# EAGLE design Sensor_Node_V2 (EAGLE 9.6.2)
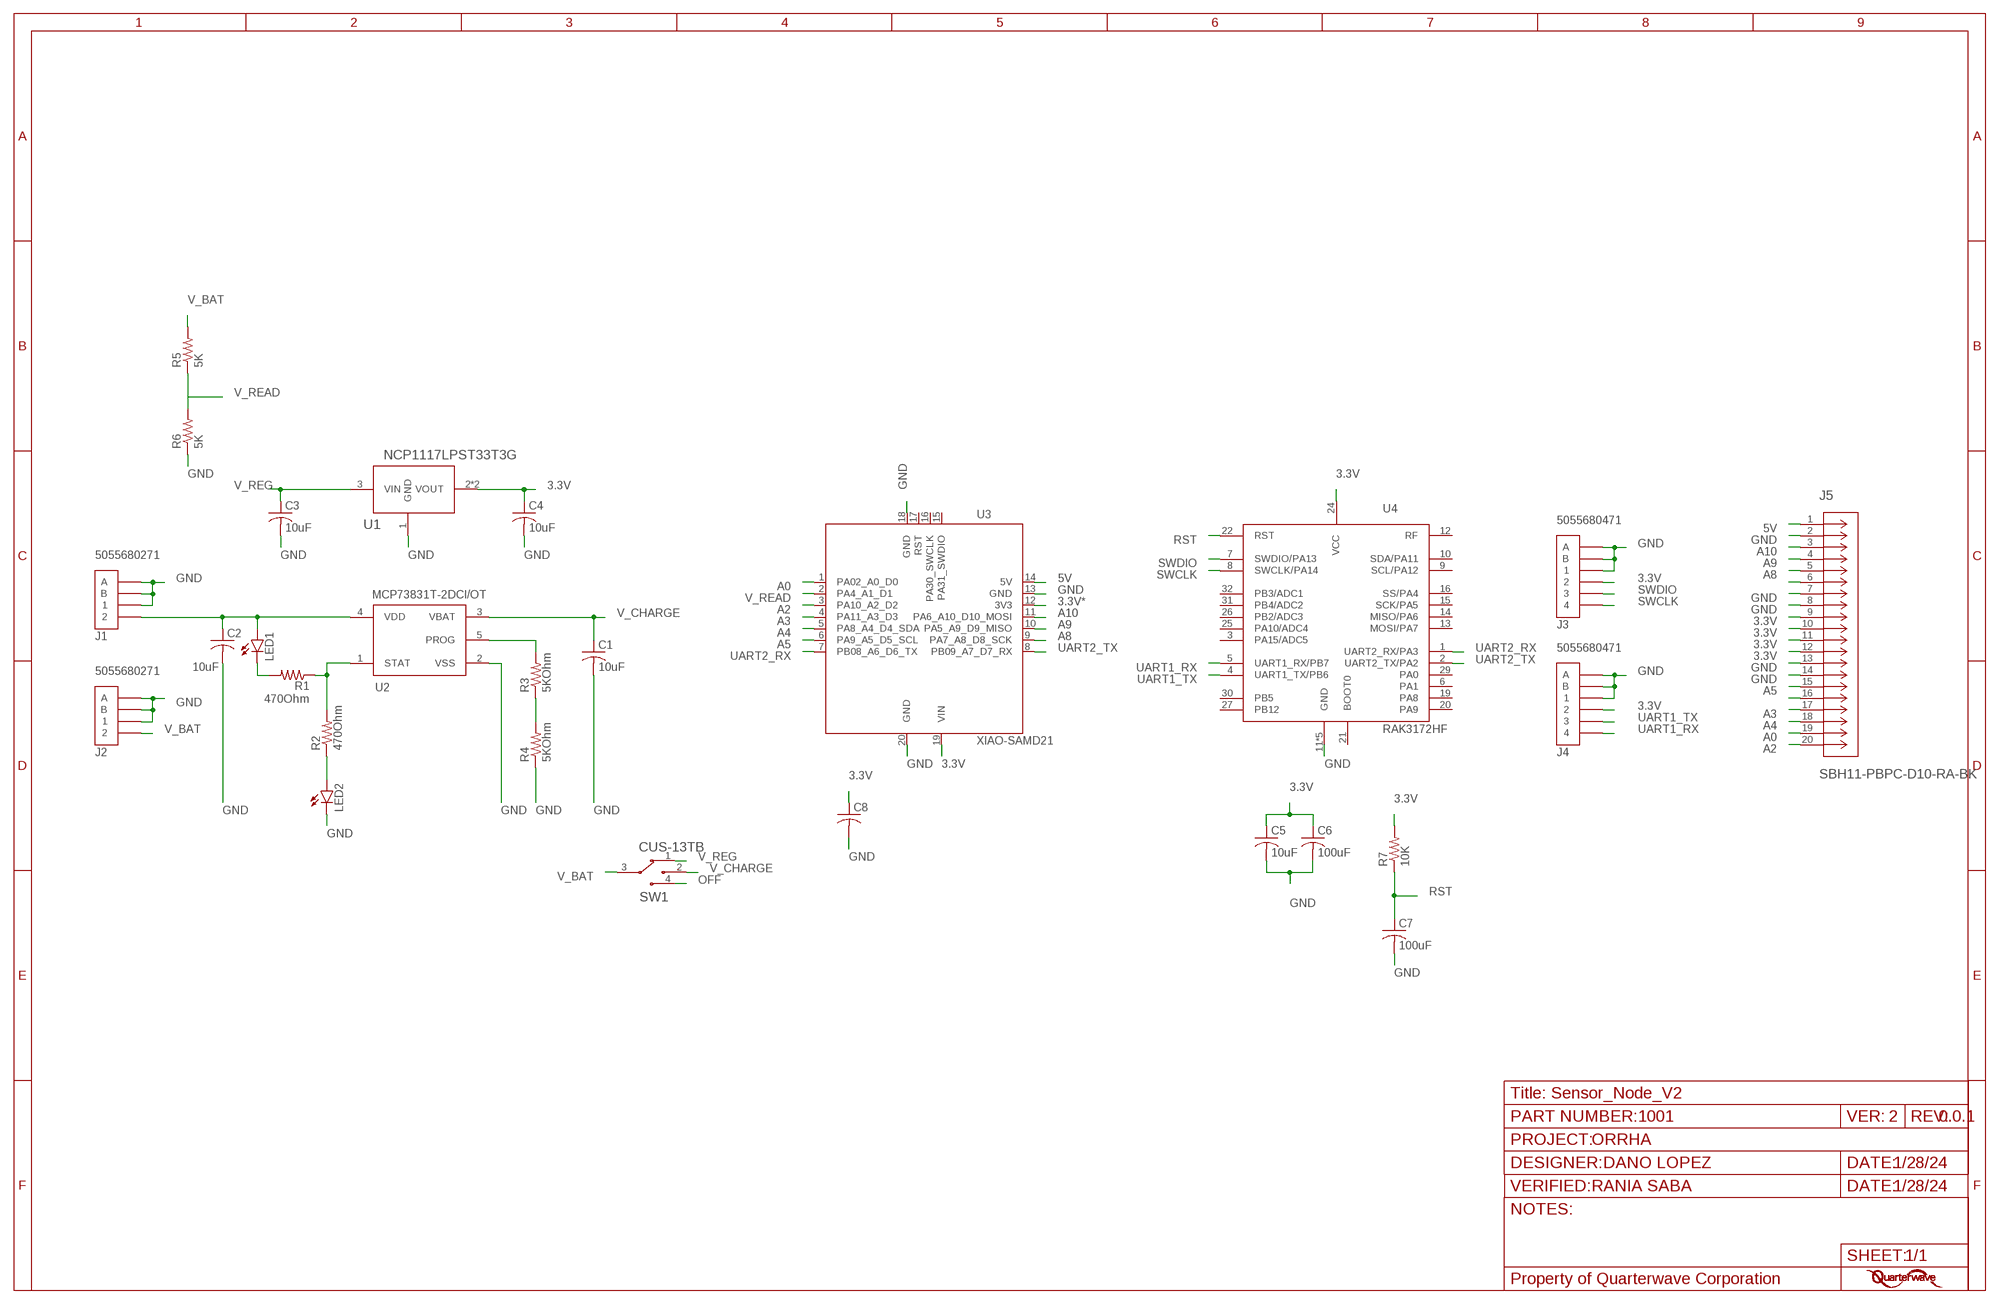
[diagram p0: schematic, sheet 1]

## Parts
C1  10uF  C-USC0805  [C0805]
C2  10uF  C-USC0805  [C0805]
C3  10uF  C-USC0805  [C0805]
C4  10uF  C-USC0805  [C0805]
C5  10uF  C-USC0805  [C0805]
C6  100uF  C-USC0805  [C0805]
C7  100uF  C-USC0805  [C0805]
C8  C-USC0805  [C0805]
FRAME1  STANDARDSTD_INFO_HW14_W30  [STD_INFO_H14_W30]
J1  5055680271  [5055680271]
J2  5055680271  [5055680271]
J3  5055680471  [5055680471]
J4  5055680471  [5055680471]
J5  SBH11-PBPC-D10-RA-BK  [CONN20_D10-RA-BK_SUL]
LED1  LEDCHIPLED_0603  [CHIPLED_0603]
LED2  LEDCHIPLED_0603  [CHIPLED_0603]
R1  470Ohm  R-US_R0805  [R0805]
R2  470Ohm  R-US_R0805  [R0805]
R3  5KOhm  R-US_R0805  [R0805]
R4  5KOhm  R-US_R0805  [R0805]
R5  5K  R-US_R0805  [R0805]
R6  5K  R-US_R0805  [R0805]
R7  10K  R-US_R0805  [R0805]
SW1  CUS-13TB  [CUS-13TB_NDC]
U1  NCP1117LPST33T3G  [SOT-223_DIO]
U2  MCP73831T-2DCI/OT  [SOT-23-5_MC_MCH]
U3  XIAO-SAMD21  [XIAO-SAMD21/RP2040-MODULE14P-2.54-21X17.8MM]
U4  RAK3172HF  [RAK3172]

## Nets
3.3V: C4.1 C5.1 C6.1 C8.1 J3.2 J4.2 J5.9 J5.10 J5.11 J5.12 R7.2 U1.2(VOUT) U1.4(VOUT) U3.19(VIN) U4.24(VCC)
3.3V*: U3.12(3V3)
5V: J5.1 U3.14(5V)
A0: J5.19 U3.1(PA02_A0_D0)
A2: J5.20 U3.3(PA10_A2_D2)
A3: J5.17 U3.4(PA11_A3_D3)
A4: J5.18 U3.5(PA8_A4_D4_SDA)
A5: J5.15 U3.6(PA9_A5_D5_SCL)
A8: J5.5 U3.9(PA7_A8_D8_SCK)
A9: J5.4 U3.10(PA5_A9_D9_MISO)
A10: J5.3 U3.11(PA6_A10_D10_MOSI)
GND: C1.2 C2.2 C3.2 C4.2 C5.2 C6.2 C7.2 C8.2 J1.1 J1.A J1.B J2.1 J2.A J2.B J3.1 J3.A J3.B J4.1 J4.A J4.B J5.2 J5.7 J5.8 J5.13 J5.14 LED2.C R4.1 R6.1 U1.1(GND) U2.2(VSS) U3.13(GND) U3.18(GND) U3.20(GND) U4.11(GND) U4.17(GND) U4.18(GND) U4.23(GND) U4.28(GND)
N$1: LED1.C R1.2
N$2: R1.1 R2.2 U2.1(STAT)
N$3: R3.2 U2.5(PROG)
N$4: R3.1 R4.2
N$7: LED2.A R2.1
N$11: C2.1 J1.2 LED1.A U2.4(VDD)
N$12: J5.6
N$22: J5.16
OFF: SW1.4
RST: C7.1 R7.1 U4.22(RST)
SWCLK: J3.4 U4.8(SWCLK/PA14)
SWDIO: J3.3 U4.7(SWDIO/PA13)
UART1_RX: J4.4 U4.5(UART1_RX/PB7)
UART1_TX: J4.3 U4.4(UART1_TX/PB6)
UART2_RX: U3.7(PB08_A6_D6_TX) U4.1(UART2_RX/PA3)
UART2_TX: U3.8(PB09_A7_D7_RX) U4.2(UART2_TX/PA2)
V_BAT: J2.2 R5.2 SW1.3
V_CHARGE: C1.1 SW1.2 U2.3(VBAT)
V_READ: R5.1 R6.2 U3.2(PA4_A1_D1)
V_REG: C3.1 SW1.1 U1.3(VIN)
Unconnected: U3.15(PA31_SWDIO) U3.16(PA30_SWCLK) U3.17(RST) U4.3(PA15/ADC5) U4.6(PA1) U4.9(SCL/PA12) U4.10(SDA/PA11) U4.12(RF) U4.13(MOSI/PA7) U4.14(MISO/PA6) U4.15(SCK/PA5) U4.16(SS/PA4) U4.19(PA8) U4.20(PA9) U4.21(BOOT0) U4.25(PA10/ADC4) U4.26(PB2/ADC3) U4.27(PB12) U4.29(PA0) U4.30(PB5) U4.31(PB4/ADC2) U4.32(PB3/ADC1)

## Library data of the parts
C1-C8 = rcl:C-US: CAPACITOR, American symbol; SPICEPREFIX: C
FRAME1 = QW Frame:STANDARD: FRAME B Size , 11 x 17 INCH, Landscape; COMPLETE_DATE: 1/28/24; DESIGNER_NAME: DANO LOPEZ; PART_NUMBER: 1001; PROJECT_NAME: ORRHA; R: 0.0.1; V: 2; VERIFIER_NAME: RANIA SABA; VERIFY_DATE: 1/28/24
J1 J2 = Micro-Lock Plus:5055680271: Connector Header Surface Mount 2 position 0.049" (1.25mm)
J3 J4 = Micro-Lock Plus:5055680471: Connector Header Surface Mount 4 position 0.049" (1.25mm)
J5 = SBH11-PBPC-D10-RA-BK:SBH11-PBPC-D10-RA-BK: SBH11-PBPC-D10-RA-BK Package: Through Hole, Right Angle Part Number: SBH11-PBPC-D10-RA-BK Description: Connector Header Through Hole, Right Angle 20 position 0.100" (2.54mm) Data Sheet <https://s3.amazonaws.com/catalogspreads-pdf/PAGE122%20.100%20SBH11%20SERIES%20MALE%20BOX%20HDR%20ST%20RA%20SMT.pdf>; COPYRIGHT: Copyright (C) 2024 Ultra Librarian. All rights reserved.; MANUFACTURER_PART_NUMBER: SBH11-PBPC-D10-RA-BK; MFR_NAME: Sullins
LED1 LED2 = led:LED: LED OSRAM: - CHIPLED LG R971, LG N971, LY N971, LG Q971, LY Q971, LO R971, LY R971 LH N974, LH R974 LS Q976, LO Q976, LY Q976 LO Q996 - Hyper CHIPLED LW Q18S LB Q993, LB Q99A, LB R99A - SideLED LS A670, LO A670, LY A670, LG A670, LP A670 LB A673, LV A673, LT A673, LW A673 LH A674 LY A675 LS A676, LA A676, LO A676, LY A676, LW A676 LS A679, LY A679, LG A679 - Hyper Micro SIDELED® LS Y876, LA Y876, LO Y876, LY Y876 LT Y87S - SmartLED LW L88C, LW L88S LB L89C, LB L89S, LG L890 LS L89K, LO L89K, LY L89K LS L896, LA L896, LO L896, LY L896 - TOPLED LS T670, LO T670, LY T670, LG T670, LP T670 LSG T670, LSP T670, LSY T670, LOP T670, LYG T670 LG T671, LOG T671, LSG T671 LB T673, LV T673, LT T673, LW T673 LH T674 LS T676, LA T676, LO T676, LY T676, LB T676, LH T676, LSB T676, LW T676 LB T67C, LV T67C, LT T67C, LS T67K, LO T67K, LY T67K, LW E67C LS E67B, LA E67B, LO E67B, LY E67B, LB E67C, LV E67C, LT E67C LW T67C LS T679, LY T679, LG T679 LS T770, LO T770, LY T770, LG T770, LP T770 LB T773, LV T773, LT T773, LW T773 LH T774 LS E675, LA E675, LY E675, LS T675 LS T776, LA T776, LO T776, LY T776, LB T776 LHGB T686 LT T68C, LB T68C - Hyper Mini TOPLED® LB M676 - Mini TOPLED Santana® LG M470 LS M47K, LO M47K, LY M47K Source: http://www.osram.convergy.de LUXEON: - LUMILED® LXK2-PW12-R00, LXK2-PW12-S00, LXK2-PW14-U00, LXK2-PW14-V00 LXK2-PM12-R00, LXK2-PM12-S00, LXK2-PM14-U00 LXK2-PE12-Q00, LXK2-PE12-R00, LXK2-PE12-S00, LXK2-PE14-T00, LXK2-PE14-U00 LXK2-PB12-K00, LXK2-PB12-L00, LXK2-PB12-M00, LXK2-PB14-N00, LXK2-PB14-P00, LXK2-PB14-Q00 LXK2-PR12-L00, LXK2-PR12-M00, LXK2-PR14-Q00, LXK2-PR14-R00 LXK2-PD12-Q00, LXK2-PD12-R00, LXK2-PD12-S00 LXK2-PH12-R00, LXK2-PH12-S00 LXK2-PL12-P00, LXK2-PL12-Q00, LXK2-PL12-R00 Source: www.luxeon.com KINGBRIGHT: KA-3528ASYC Source: www.kingbright.com
R1-R7 = rcl:R-US_: RESISTOR, American symbol; SPICEPREFIX: R
SW1 = CUS-13TB:CUS-13TB: Slide Switch SP3T Surface Mount, Right Angle; COPYRIGHT: Copyright (C) 2021 Ultra Librarian. All rights reserved.; DIGI-KEY_PART_NUMBER_1: 563-1103-2-ND; DIGI-KEY_PART_NUMBER_2: 563-1103-1-ND; DIGI-KEY_PART_NUMBER_3: 563-1103-6-ND; MANUFACTURER_PART_NUMBER: CUS-13TB; MFR_NAME: Nidec Copal Electronics
U1 = NCP1117LPST33T3G:NCP1117LPST33T3G: NCP1117LPST33T3G Package: SOT-223 Part Number: NCP1117LPST33T3G Description: Linear Voltage Regulator IC Positive Fixed 1 Output 1A SOT-223 Data Sheet <https://www.onsemi.com/pdf/datasheet/ncp1117lp-d.pdf>
U2 = MCP73831T-2DCI_OT:MCP73831T-2DCI/OT: MCP73831T-2DCI/OT Package: SOT-23-5 Part Number: MCP73831T-2DCI/OT Description: Charger IC Lithium Ion/Polymer SOT-23-5 Battery Pack Voltage 4.2V Data Sheet <https://ww1.microchip.com/downloads/en/DeviceDoc/MCP73831-Family-Data-Sheet-DS20001984H.pdf>; COPYRIGHT: Copyright (C) 2022 Ultra Librarian. All rights reserved.; DIGI-KEY_PART_NUMBER_1: MCP73831T-2DCI/OTCT-ND; DIGI-KEY_PART_NUMBER_2: MCP73831T-2DCI/OTDKR-ND; DIGI-KEY_PART_NUMBER_3: MCP73831T-2DCI/OTTR-ND; MANUFACTURER_PART_NUMBER: MCP73831T-2DCI/OT; MFR_NAME: Microchip
U3 = Seeed Studio XIAO Series:XIAO-SAMD21: Seeed Studio XIAO SAMD21 - Microchip ATSAMD21G18 Arduino Microcontroller - 32-bit 48MHz ARM® Cortex® M0+ processor （Seeeduino XIAO) Seeed SKU: 102010328 Seeed Studio XIAO SAMD21 is the smallest Arduino compatible board in Seeeduino Family. It is an Arduino microcontroller that is embedded with the SAMD21 microchip. The interfaces of Seeed Studio XIAO SAMD21 are rich for such a tiny development board and the castellated hole design facilitates automated SMD assembly. Buy now <https://www.seeedstudio.com/Seeeduino-XIAO-Arduino-Microcontroller-SAMD21-Cortex-M0+-p-4426.html> Wiki <https://wiki.seeedstudio.com/Seeeduino-XIAO/>
U4 = RAK3172:RAK3172: RAK3172 Package: 32-SMD Module Part Number: RAK3172 Description: RF IC Transceiver LoRaWAN 915MHz, 920MHz, 923MHz 2V ~ 3.6V Supply Data Sheet <https://docs.rakwireless.com/Product-Categories/WisDuo/RAK3172-Module/Datasheet/#overview>; AVAILABILITY: Not in stock; CHECK_PRICES: https://www.snapeda.com/parts/RAK3172/Shenzhen+RAKwireless+Technology+Co.%252CLtd./view-part/?ref=eda; DESCRIPTION: RAK3172 is a low-power long-range transceiver module based on the STM32WLE5CC chip. It provides an easy-to-use, small-size, low-power solution for long range wireless data applications; MF: Shenzhen RAKwireless Technology Co.,Ltd.; MP: RAK3172; PACKAGE: Package; PRICE: None; SNAPEDA_LINK: https://www.snapeda.com/parts/RAK3172/Shenzhen+RAKwireless+Technology+Co.%252CLtd./view-part/?ref=snap

## Board
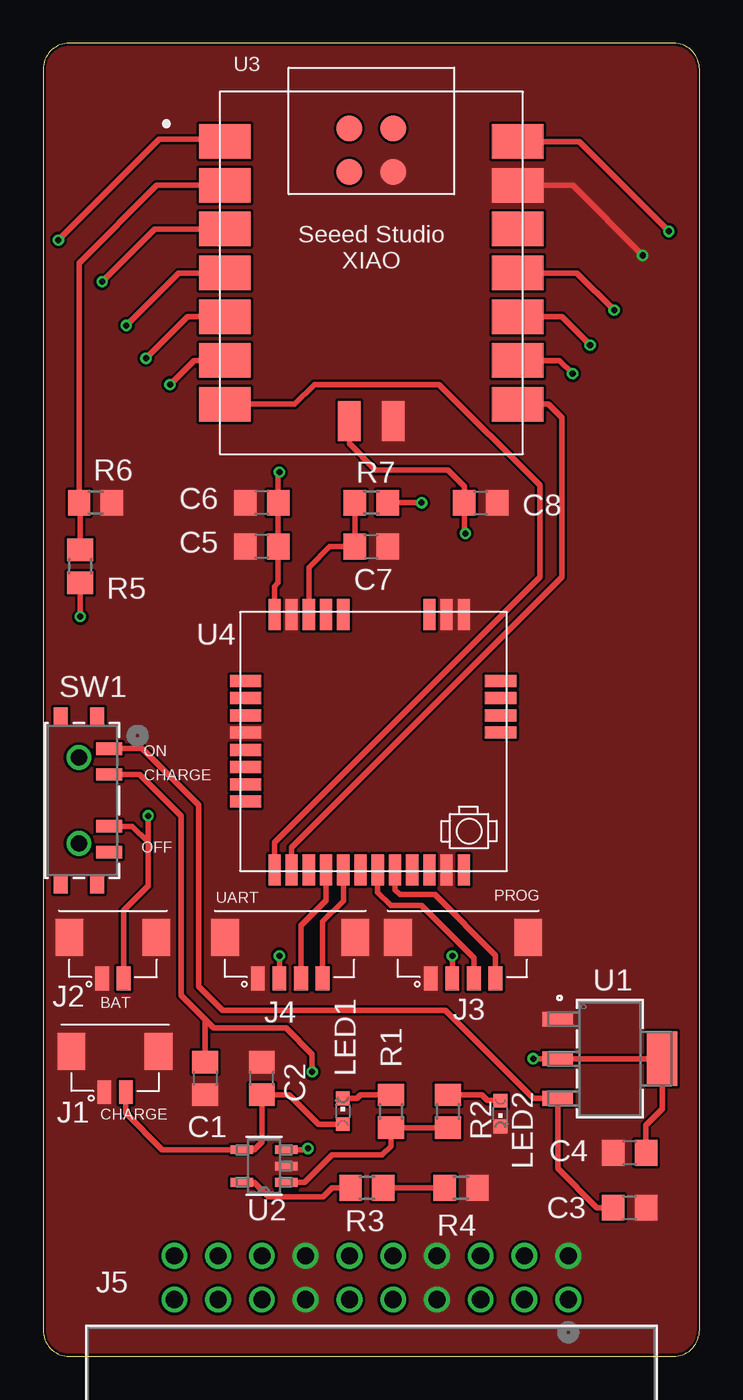
[diagram p1: board, top side]
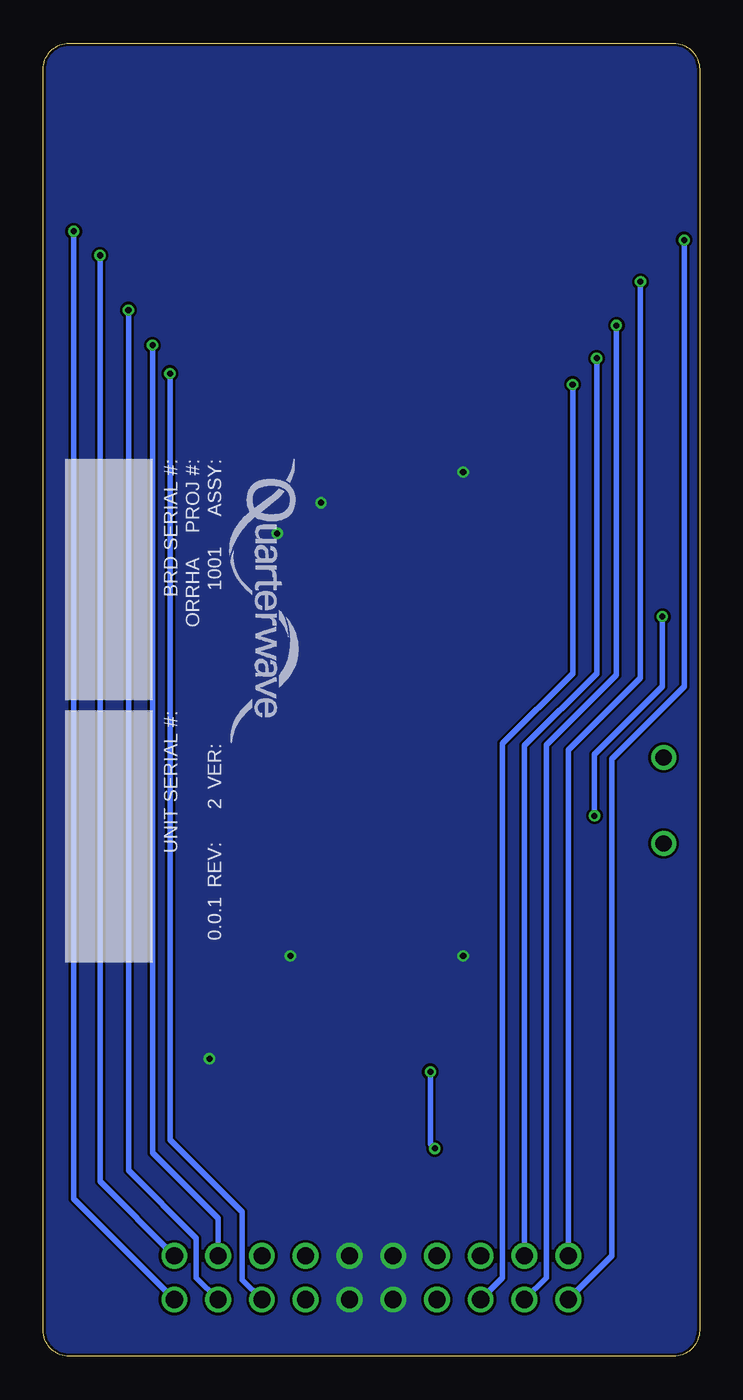
[diagram p2: board, bottom side, seen from below]

Size 38.1 x 76.2 mm. Coordinates in mm from the lower left corner, seen from the top.
Outline: 0,74.68 0,1.52 arc90 1.52,0 36.58,0 arc90 38.1,1.52 38.1,74.68 arc90 36.58,76.2 1.52,76.2 arc90 0,74.68
Copper layers (1*16): Top 0.035mm / dielectric 1.5mm / Bottom 0.035mm
Design rules "SparkFun-2-layer-PCBWay-LIMIT": minimum track width 6mil, minimum drill 0.3mm, track to track 6mil, track to pad 6mil, pad to pad 6mil, via to via 6mil, smd to smd 6mil, copper to edge 6mil, drill to drill 6mil, minimum pad ring 6mil, minimum via ring 6mil, stop-mask expansion 4mil, vias tented up to drill 25mil, thermal gap 10mil

### Footprints (pad centres in the part's own frame; a part is rotated, then mirrored left to right if it is on the bottom)
C0805 = smd 1.3 x 1.5: 1 -0.95,0; 2 0.95,0
5055680271 = smd 0.8 x 1.372: 1 0,-2.576; 2 1.25,-2.576 | smd 1.6 x 2.15: A -1.9,-0.205; B 3.15,-0.205
5055680471 = smd 0.8 x 1.372: 1 -1.25,-2.576; 2 0,-2.576; 3 1.25,-2.576; 4 2.5,-2.576 | smd 1.6 x 2.15: A -3.15,-0.205; B 4.4,-0.205
CONN20_D10-RA-BK_SUL = drill 0.991 pad 1.499: 1 -11.43,-6.35; 2 -11.43,-8.89; 3 -8.89,-6.35; 4 -8.89,-8.89; 5 -6.35,-6.35; 6 -6.35,-8.89; 7 -3.81,-6.35; 8 -3.81,-8.89; 9 -1.27,-6.35; 10 -1.27,-8.89; 11 1.27,-6.35; 12 1.27,-8.89; 13 3.81,-6.35; 14 3.81,-8.89; 15 6.35,-6.35; 16 6.35,-8.89; 17 8.89,-6.35; 18 8.89,-8.89; 19 11.43,-6.35; 20 11.43,-8.89
CHIPLED_0603 = smd 0.8 x 0.8: A 0,-0.75; C 0,0.75
R0805 = smd 1.3 x 1.5: 1 -0.95,0; 2 0.95,0
CUS-13TB_NDC = smd 0.711 x 1.499: 1 -3,2.052; 2 -1.5,2.052; 3 1.5,2.052; 4 3,2.052 | smd 0.991 x 0.813: 5 -4.9,1.352; 6 4.9,1.352; 7 -4.9,-0.748; 8 4.9,-0.748 | drill 0.94 pad 1.448: 9 -2.489,0.305; 10 2.489,0.305
SOT-223_DIO = smd 0.851 x 1.761: 1 -2.3,-3.025; 2 0,-3.025; 3 2.3,-3.025 | smd 3.151 x 1.761: 4 0,3.025
SOT-23-5_MC_MCH = smd 1.321 x 0.508: 1 -1.295,0.95; 2 -1.295,0; 3 -1.295,-0.95; 4 1.295,-0.95; 5 1.295,0.95
XIAO-SAMD21/RP2040-MODULE14P-2.54-21X17.8MM = smd 3 x 2: 1 -8.5,7.62; 2 -8.5,5.08; 3 -8.5,2.54; 4 -8.5,0; 5 -8.5,-2.54; 6 -8.5,-5.08; 7 -8.5,-7.62; 8 8.5,-7.62; 9 8.5,-5.08; 10 8.5,-2.54; 11 8.5,0; 12 8.5,2.54; 13 8.5,5.08; 14 8.5,7.62 | smd 1.5 x 1.5: 15 -1.27,8.39; 16 1.27,8.39; 17 -1.27,5.85; 18 1.27,5.85 | smd 1.3 x 2.3: 19 -1.27,-8.6; 20 1.27,-8.6
RAK3172 = smd 0.7 x 1.8: 1 5.88,6.055; 2 4.88,6.055; 3 3.88,6.055; 4 2.88,6.055; 5 1.88,6.055; 6 0.88,6.055; 7 -0.12,6.055; 8 -1.12,6.055; 9 -2.12,6.055; 10 -3.12,6.055; 11 -4.12,6.055; 12 -5.12,6.055; 17 -5.12,-8.745; 18 -4.12,-8.745; 19 -3.12,-8.745; 20 1.88,-8.745; 21 2.88,-8.745; 22 3.88,-8.745; 23 4.88,-8.745; 24 5.88,-8.745 | smd 1.8 x 0.7: 13 -7.255,-1.9; 14 -7.255,-2.9; 15 -7.255,-3.9; 16 -7.255,-4.9; 25 7.545,-4.9; 26 7.545,-3.9; 27 7.545,-2.9; 28 7.545,-1.9; 29 7.545,-0.9; 30 7.545,0.1; 31 7.545,1.1; 32 7.545,2.1

### Placement (x,y rotation side)
C1  9.4,16.13 270 top
C2  12.7,16.13 90 top
C3  34.04,8.64 0 top
C4  34.04,11.81 180 top
C5  12.7,46.99 180 top
C6  12.7,49.53 180 top
C7  19.05,46.99 0 top
C8  25.4,49.53 0 top
FRAME1  36.83,52.07 270 bottom
J1  3.56,17.91 0 top
J2  3.43,24.51 0 top
J3  23.75,24.51 0 top
J4  13.72,24.51 0 top
J5  19.05,-3.05 180 top
LED1  17.4,14.22 0 top
LED2  26.54,14.1 180 top
R1  20.19,14.22 90 top
R2  23.5,14.22 270 top
R3  18.8,9.78 180 top
R4  24.26,9.78 180 top
R5  2.16,45.85 270 top
R6  3.05,49.53 180 top
R7  19.05,49.53 0 top
SW1  1.78,32.26 270 top
U1  32.89,17.27 270 top
U2  12.83,11.05 180 top
U3  19.05,62.87 0 top
U4  19.3,34.29 180 top

### Tracks (layer width: path | path; a pad name or v marks a point on that pad's centre or on a via)
3.3V  (via drill 0.35)
  Top 0.305: C4.1 34.99,13.4 35.94,14.35 35.94,17.25 U1.4 U1.2 v28.45,17.27 | U4.24 13.42,44.67 13.65,44.89 C5.1 C6.1 13.65,51.24 v13.72,51.31 | U3.19 17.78,52.96 19.3,51.44 23.5,51.44 24.45,50.48 C8.1 24.45,47.81 v24.51,47.75 | R7.2 v21.97,49.53 | J4.2 v13.72,23.24 | J3.2 v23.75,23.24
  pour Bottom (no thermals): 0,74.68 0,1.52 arc90 1.52,0 36.58,0 arc90 38.1,1.52 38.1,74.68 arc90 36.58,76.2 1.52,76.2 arc90
5V  (via drill 0.35)
  Top 0.305: U3.14 31.11,70.48 v36.32,65.28
  Bottom 0.305: v36.32,65.28 36.32,9.14 J5.1
A0  (via drill 0.35)
  Top 0.305: U3.1 10.42,70.61 6.73,70.61 v0.89,64.77
  Bottom 0.305: v0.89,64.77 0.89,38.86 5.08,34.67 5.08,5.84 J5.19
A2  (via drill 0.35)
  Top 0.305: U3.3 6.48,65.41 v3.43,62.36
  Bottom 0.305: v3.43,62.36 3.43,39.37 7.62,35.18 J5.20
A3  (via drill 0.35)
  Top 0.305: U3.4 7.87,62.87 v4.83,59.82
  Bottom 0.305: v4.83,59.82 4.83,39.53 8.89,35.46 8.89,4.57 J5.17
A4  (via drill 0.35)
  Top 0.305: U3.5 8.38,60.33 v5.97,57.91
  Bottom 0.305: v5.97,57.91 5.97,39.62 10.16,35.43 J5.18
A5  (via drill 0.35)
  Top 0.305: U3.6 8.76,57.78 v7.37,56.39
  Bottom 0.305: v7.37,56.39 7.37,39.62 11.43,35.56 11.43,4.57 J5.15
A8  (via drill 0.35)
  Top 0.305: U3.9 29.97,57.78 v30.73,57.02
  Bottom 0.305: v30.73,57.02 30.73,12.57 26.54,8.38 26.54,4.45 J5.5
A9  (via drill 0.35)
  Top 0.305: U3.10 30.1,60.33 v31.75,58.67
  Bottom 0.305: v31.75,58.67 31.75,11.81 27.94,8 J5.4
A10  (via drill 0.35)
  Top 0.305: U3.11 30.99,62.87 v33.15,60.71
  Bottom 0.305: v33.15,60.71 33.15,10.79 29.21,6.86 29.21,4.57 J5.3
GND  (via drill 0.35)
  Top 0.305: U3.13 30.73,67.94 v34.8,63.88
  Bottom 0.305: v34.8,63.88 34.8,10.16 J5.2
  pour Top (no thermals): 0,74.68 0,1.52 arc90 1.52,0 36.58,0 arc90 38.1,1.52 38.1,74.68 arc90 36.58,76.2 1.52,76.2 arc90
N$1
  Top 0.305: LED1.C 18.21,14.97 18.41,15.17 R1.2
N$2
  Top 0.305: R2.2 R1.1 20.19,12.19 19.68,11.68 16.76,11.68 15.18,10.1 U2.1
N$3
  Top 0.305: R3.2 16.76,9.78 16.26,9.27 13.08,9.27 12.25,10.1 U2.5
N$4
  Top 0.305: R3.1 R4.2
N$7
  Top 0.305: LED2.A 25.79,14.85 25.47,15.17 R2.1
N$11
  Top 0.305: J1.2 4.81,14.12 6.92,12 U2.4 12.25,12 12.7,12.45 C2.1 14.29,15.18 15.99,13.47 LED1.A
RST
  Top 0.305: R7.1 C7.1 16.64,46.99 15.42,45.78 U4.22
SWCLK
  Top 0.305: U4.8 20.42,27.07 20.7,26.8 22.73,26.8 26.25,23.28 J3.4
SWDIO
  Top 0.305: U4.7 19.42,26.93 20.19,26.16 21.97,26.16 25,23.13 J3.3
UART1_RX
  Top 0.305: J4.4 16.22,25.23 17.42,26.44 U4.5
UART1_TX
  Top 0.305: J4.3 14.97,25 16.42,26.46 U4.4
UART2_RX
  Top 0.305: U3.7 14.61,55.24 15.75,56.39 22.99,56.39 28.83,50.55 28.83,45.21 13.42,29.81 U4.1
UART2_TX
  Top 0.305: U3.8 29.34,55.24 30.1,54.48 30.1,45.21 14.42,29.54 U4.2
V_BAT  (via drill 0.35)
  Top 0.305: J2.2 4.68,25.89 6.1,27.3 6.1,29.84 | 6.1,29.84 5.18,30.76 SW1.3 | 6.1,29.84 v6.1,31.37 | v2.16,42.93 R5.2
  Bottom 0.305: v6.1,31.37 6.1,34.92 2.16,38.86 v2.16,42.93
V_CHARGE  (via drill 0.35)
  Top 0.305: SW1.2 5.61,33.76 8,31.37 8,20.95 9.4,19.56 | 9.4,19.56 C1.1 | 9.4,19.56 9.91,19.05 14.1,19.05 15.62,17.53 v15.62,16.51 | v15.37,12.06 15.3,12 U2.3
  Bottom 0.305: v15.62,16.51 15.62,12.32 v15.37,12.06
V_READ
  Top 0.305: U3.2 6.6,67.94 2.1,63.44 R6.2 2.16,49.47 R5.1
V_REG
  Top 0.305: SW1.1 5.76,35.26 9.02,32 9.02,21.46 10.41,20.07 23.37,20.07 28.46,14.97 U1.3 29.87,10.9 32.13,8.64 C3.1

### Text on the board
tPlace: ON | CHARGE | OFF | UART | PROG | BAT | CHARGE